# Altium schematic sheet SH5 - 3.3V BUCK CONVERTER.SchDoc: Power Distribution Board Rev2 - 3.3V Buck Converter
size Letter; DrawnBy: Cindy Li; Organization: Altium Limited; Address1: L3, 12a Rodborough Rd; Address2: Frenchs Forest; Address3: NSW; Address4: Australia 2086
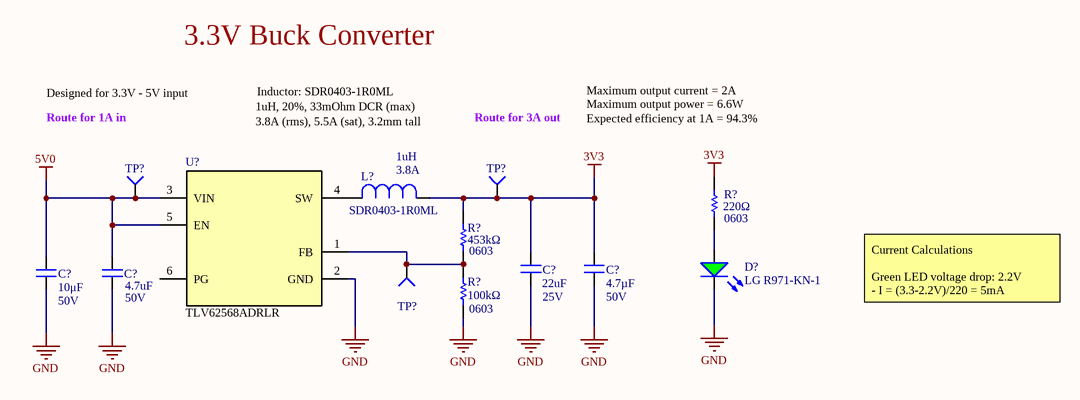
[diagram p0: SH5 - 3.3V BUCK CONVERTER.SchDoc]

## Parts
(Parts that share a designator on the sheet are numbered #1, #2 ... from top to bottom, then left to right.)
C?#1  Voltage: 25V  Capacitance: 22uF  [CAPC3225X270N]  (hidden comment: GRM32ER71E226ME15K)
C?#2  4.7µF  Voltage: 50V  [CAP1206]
C?#3  value 10μF  Voltage Rating: 50V  [CAP1206]  (hidden comment: 10uF)
C?#4  Capacitance: 4.7uF  Voltage: 50V  [CAP1206]  (hidden comment: 4.7µF)
D?  LG R971-KN-1  [LED_0805_GREEN]
L?  value 1uH  Manufacturer Part Number 1: SDR0403-1R0ML  Current Rating: 3.8A  [IND_BOURNS_SDR04]  (hidden comment: IND_1uH_3.8A)
R?#1  value 220Ω  Case Code (Imperial): 0603  [RESC0603(1608)_N]  (hidden comment: RES_220Ω_0603)
R?#2  value 453kΩ  Package: 0603  [RESC0603(1608)_N]  (hidden comment: RES_453kΩ_0603)
R?#3  value 100kΩ  Package: 0603  [RESC0603(1608)_N]  (hidden comment: RES_100kΩ_0603_1%)
TP?#1  TESTPOINT_SMD_LOOP  [S1751-46R]  (value not drawn)
TP?#2  TESTPOINT_SMD_LOOP  [S1751-46R]  (value not drawn)
TP?#3  TESTPOINT_SMD_LOOP  [S1751-46R]  (value not drawn)
U?  TLV62568ADRLR  [SOT50P160X60-6N]

## Nets
3V3: C?#1.2 C?#2.2 L?.2 R?#1.2 R?#2.2 TP?#2.1(=value)
5V0: C?#3.2 C?#4.2 TP?#1.1(=value) U?.3(VIN) U?.5(EN)
GND: C?#1.1 C?#2.1 C?#3.1 C?#4.1 D?.2(K) R?#3.1 U?.2(GND)
NetD?_1: D?.1(A) R?#1.1
NetL?_1: L?.1 U?.4(SW)
NetR?#2_1: R?#2.1 R?#3.2 TP?#3.1(=value) U?.1(FB)

Not connected (* = marked no-connect by the designer): U? 6(PG)

## Notes on the sheet
- 3.3V Buck Converter
- Designed for 3.3V - 5V input
- Route for 1A in
- 1uH, 20%, 33mOhm DCR (max)
- 3.8A (rms), 5.5A (sat), 3.2mm tall
- Inductor: SDR0403-1R0ML
- Route for 3A out
- Maximum output current = 2A
- Maximum output power = 6.6W
- Expected efficiency at 1A = 94.3%
- Current Calculations
  Green LED voltage drop: 2.2V
  - I = (3.3-2.2V)/220 = 5mA
- Title
- Size:
- Date:
- Letter
- Drawn By:
- Sheet
- of
- File:

## Library data of the parts
C?#1 = GRM32ER71E226ME15K: CAP CER 22UF 25V X7R 1210; Manufacturer 1: Murata Electronics; Tolerance: ±20%; Manufacturer Part Number 1: GRM32ER71E226ME15K; Supplier 1: Digi-Key; Supplier Part Number 1: 490-14682-1-ND; Package: 1210 (3225 Metric)
C?#2 = CAP_4.7µF_50V_1206: CAP CER 4.7UF 50V X7R 1206; Manufacturer 1: Murata; Manufacturer Part Number 1: GRM31CR71H475KA12L; Material: Ceramic; Tolerance: 10%; Supplier 1: Digi-Key; Mount: Surface Mount; Package: 1206 (3216 Metric); Case Code (Metric): 3216; Case Code (Imperial): 1206; Min Operating Temperature: -55°C; Max Operating Temperature: 125°C; Capacitance: 4.7uF; Voltage Rating: 50V; Voltage Rating (DC): 50V; Termination: SMD/SMT; Dielectric: X7R; Length: 3.2mm; Height: 1.6mm; Width: 0.063inch; Thickness: 0.071inch; Depth: 1.6mm; REACH SVHC: No SVHC; ComponentLink7URL: https://datasheet.ciiva.com/6270/partnumbering-e-01-6270217.pdf?src-supplier=Digi-Key; ComponentLink7Description: https://datasheet.ciiva.com/6270/partnumbering-e-01-6270217.pdf?src-supplier=Digi-Key; ComponentLink8URL: https://datasheet.ciiva.com/6270/partnumbering-e-01-6270218.pdf?src-supplier=Digi-Key; ComponentLink8Description: https://datasheet.ciiva.com/6270/partnumbering-e-01-6270218.pdf?src-supplier=Digi-Key; Supplier Part Number 1: 490-6521-1-ND
C?#3 = CAP_10uF_50V_1206: CAP CER 10UF 50V X5R 1206; Manufacturer Part Number 1: GRT31CR61H106KE01L; Manufacturer 1: Murata; Dimensions: 0.126" L x 0.063" W (3.20mm x 1.6mm); Package: 1206 (3216 Metric); Supplier Part Number 1: 490-12456-1-ND; Supplier 1: Digi-Key; Mount: Surface Mount; Case Code (Imperial): 1206; Case Code (Metric): 3216; Dielectric: X5R; Manufacturer Part Numer 1: GRT31CR61H106KE01L
C?#4 = CAP_4.7µF_50V_1206: CAP CER 4.7UF 50V X7R 1206; Manufacturer Part Number 1: GRM31CR71H475KA12L; Manufacturer 1: Murata; Tolerance: 10%; Material: Ceramic; Supplier Part Number 1: 490-6521-1-ND; Supplier 1: Digi-Key; Mount: Surface Mount; Voltage Rating: 50V; Case Code (Metric): 3216; Case Code (Imperial): 1206; Min Operating Temperature: -55°C; Max Operating Temperature: 125°C; Package: 1206 (3216 Metric); Voltage Rating (DC): 50V; Termination: SMD/SMT; Length: 3.2mm; Height: 1.6mm; Width: 0.063inch; Thickness: 0.071inch; Depth: 1.6mm; REACH SVHC: No SVHC; ComponentLink7URL: https://datasheet.ciiva.com/6270/partnumbering-e-01-6270217.pdf?src-supplier=Digi-Key; ComponentLink7Description: https://datasheet.ciiva.com/6270/partnumbering-e-01-6270217.pdf?src-supplier=Digi-Key; ComponentLink8URL: https://datasheet.ciiva.com/6270/partnumbering-e-01-6270218.pdf?src-supplier=Digi-Key; ComponentLink8Description: https://datasheet.ciiva.com/6270/partnumbering-e-01-6270218.pdf?src-supplier=Digi-Key; Dielectric: X7R
D? = DIO_LED_G: LED GREEN DIFFUSED 0805 SMD; Manufacturer 1: OSRAM; Forward Voltage Drop: 2.2V; Package: 0805 (2012 Metric); Supplier Part Number 1: 475-1410-1-ND; Supplier 1: Digi-Key; Manufacturer Part Number 1: LG R971-KN-1; Mount: Surface Mount
L? = IND_1uH_3.8A: FIXED IND 1UH 3.8A 33 MOHM SMD; Manufacturer 1: Bourns Inc.; Tolerance: ±20%; Supplier Part Number 1: SDR0403-1R0MLCT-ND; Supplier 1: Digi-Key
R?#1 = RES_220Ω_0603: RES SMD 220 OHM 5% 1/10W 0603; Manufacturer 1: Yageo; Manufacturer Part Number 1: AC0603JR-07220RL; Package: 0603 (1608 Metric); Dimensions: 0.063" L x 0.031" W (1.60mm x 0.80mm); Tolerance: 5%; Supplier Part Number 1: YAG3652CT-ND; Supplier 1: Digi-Key; Mount: Surface Mount; Case Code (Metric): 1608
R?#2 = RES_453kΩ_0603: RES SMD 453K OHM 1% 1/10W 0603; Manufacturer 1: Panasonic Electronic Components; Manufacturer Part Number 1: ERJ-3EKF4533V; Dimensions: 0.063" L x 0.031" W (1.60mm x 0.80mm); Supplier Part Number 1: P453KHCT-ND; Supplier 1: Digi-Key; Mount: Surface Mount; Case Code (Metric): 1608; Tolerance: 1%; Case/Package: 0603
R?#3 = RES_100kΩ_0603_1%: RES SMD 100K OHM 1% 1/10W 0603; Manufacturer 1: Yageo; Manufacturer Part Number 1: RC0603FR-07100KL; Dimensions: 0.063" L x 0.031" W (1.60mm x 0.80mm); Supplier Part Number 1: 311-100KHRCT-ND; Supplier 1: Digi-Key; Mount: Surface Mount; Case Code (Metric): 1608; Tolerance: 1%; Case/Package: 0603
TP?#1-TP?#3 = TESTPOINT_SMD_LOOP: PC TEST POINT SMD; Manufacturer 1: Harwin; Plating: Tin; Number of Ports: 1; Supplier 1: Digi-Key; Manufacturer Part Number 1: S1751-46R; RoHS: Yes; Category: Terminal Blocks; Stock 1: 159143; Pricing 1: 1=0.29000, 10=0.27700, 25=0.23760, 50=0.20200, 100=0.19400, 250=0.17424, 500=0.16632, 1000=0.13860 (USD); Mount: Surface Mount; Material: Brass,Copper Alloy; Contact Material: Copper,Copper Alloy; Contact Plating: Tin; Color: Natural; Termination: Solder; Orientation: Straight; Number of Contacts: 1; Package Quantity: 2500; Packaging: Tape and Reel; Length: 3.25mm; Height: 2mm; Depth: 2mm; Width: 1.65mm; Radiation Hardening: No; REACH SVHC: No SVHC; ComponentLink1URL: https://datasheet.ciiva.com:443/pdfs/VipMasterIC/IC/HRWN/HRWN-S-A0002541722/HRWN-S-A0004513972-1.pdf?src-supplier=IHS+Markit; ComponentLink1Description: https://datasheet.ciiva.com:443/pdfs/VipMasterIC/IC/HRWN/HRWN-S-A0002541722/HRWN-S-A0004513972-1.pdf?src-supplier=IHS+Markit; ComponentLink2URL: https://datasheet.ciiva.com/5224/2010page161-58228-5224784.pdf?src-supplier=Mouser; ComponentLink2Description: https://datasheet.ciiva.com/5224/2010page161-58228-5224784.pdf?src-supplier=Mouser; ComponentLink3URL: https://datasheet.ciiva.com/22631/1688119-22631153.pdf?src-supplier=Element14; ComponentLink3Description: https://datasheet.ciiva.com/22631/1688119-22631153.pdf?src-supplier=Element14; ComponentLink4URL: https://datasheet.ciiva.com/2917/s1751-2917604.pdf?src-supplier=Digi-Key; ComponentLink4Description: https://datasheet.ciiva.com/2917/s1751-2917604.pdf?src-supplier=Digi-Key; ComponentLink5URL: https://datasheet.ciiva.com/1462/1693781-1462652.pdf?src-supplier=Farnell; ComponentLink5Description: https://datasheet.ciiva.com/1462/1693781-1462652.pdf?src-supplier=Farnell; ComponentLink6URL: https://datasheet.ciiva.com/1454/1693781-1454941.pdf?src-supplier=Element14; ComponentLink6Description: https://datasheet.ciiva.com/1454/1693781-1454941.pdf?src-supplier=Element14; Supplier Part Number 1: 952-1478-1-ND
U? = TLV62568ADRLR: IC REG BUCK ADJUSTABLE 2A SOT563; Manufacturer 1: Texas Instruments; Vin (Min): 2.5V; Vin (Max): 5.5V; Vout (Min/Fixed): 0.6V; Iout: 1A; Switching Frequency: 1.5MHz; Supplier 1: Digi-Key; Supplier Part Number 1: 296-50407-1-ND; Vout (Max): 5.5V; Package: SOT-563, SOT-666; Iout (Max): 2A; Manufacturer Part Number 1: TLV62568ADRLR